# Altium schematic sheet RTB2k Pattern Gen Adapter.SchDoc
size A4
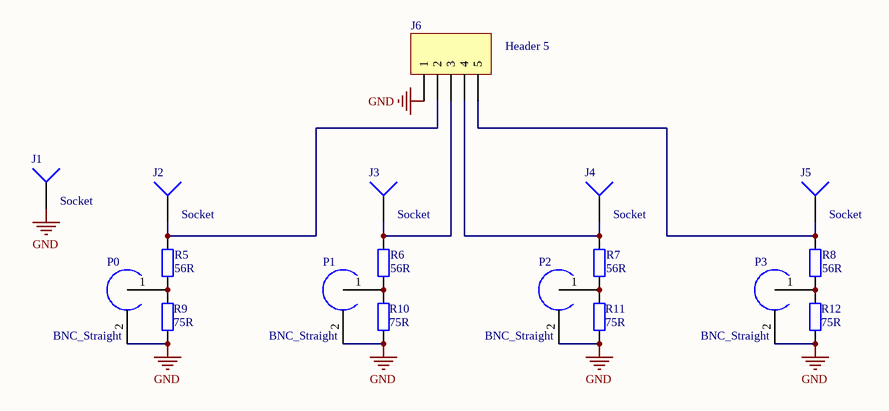
[diagram p0: RTB2k Pattern Gen Adapter.SchDoc]

## Parts
J1  Socket  [PIN1]
J2  Socket  [PIN1]
J3  Socket  [PIN1]
J4  Socket  [PIN1]
J5  Socket  [PIN1]
J6  Header 5  [HDR1X5]
P0  BNC_Straight  [BNC_Straight]
P1  BNC_Straight  [BNC_Straight]
P2  BNC_Straight  [BNC_Straight]
P3  BNC_Straight  [BNC_Straight]
R5  56R  [0805R]
R6  56R  [0805R]
R7  56R  [0805R]
R8  56R  [0805R]
R9  75R  [0805R]
R10  75R  [0805R]
R11  75R  [0805R]
R12  75R  [0805R]

## Nets
GND: J1.1 J6.1 P0.2(Shield) P1.2(Shield) P2.2(Shield) P3.2(Shield) R9.2 R10.2 R11.2 R12.2
NetJ2_1: J2.1 J6.2 R5.2
NetJ3_1: J3.1 J6.3 R6.2
NetJ4_1: J4.1 J6.4 R7.2
NetJ5_1: J5.1 J6.5 R8.2
NetP0_1: P0.1(Centre) R5.1 R9.1
NetP1_1: P1.1(Centre) R6.1 R10.1
NetP2_1: P2.1(Centre) R7.1 R11.1
NetP3_1: P3.1(Centre) R8.1 R12.1

## Library data of the parts
J6 = Header 5: Header, 5-Pin; LatestRevisionDate: 17-Jul-2002; LatestRevisionNote: Re-released for DXP Platform.; Publisher: Altium Limited
P0-P3 = BNC_Straight: BNC Connector (Straight); Value: =Value
R5-R12 = Resistor: Power: *; Tolerance: *
J1-J5 = Socket: LatestRevisionDate: 17-Jul-2002; LatestRevisionNote: Re-released for DXP Platform.; Publisher: Altium Limited